# Altium schematic sheet DSub_Analog_Input.SchDoc
size A4; CompanyName: Technische Hochschule Nürnberg Georg Simon Ohm; Organization: UltraZohm; Address1: Kesslerplatz 12; Address2: 90489 Nürnberg; Address3: GERMANY; SheetNumber: 3; SheetTotal: 6; Website: www.ultrazohm.com
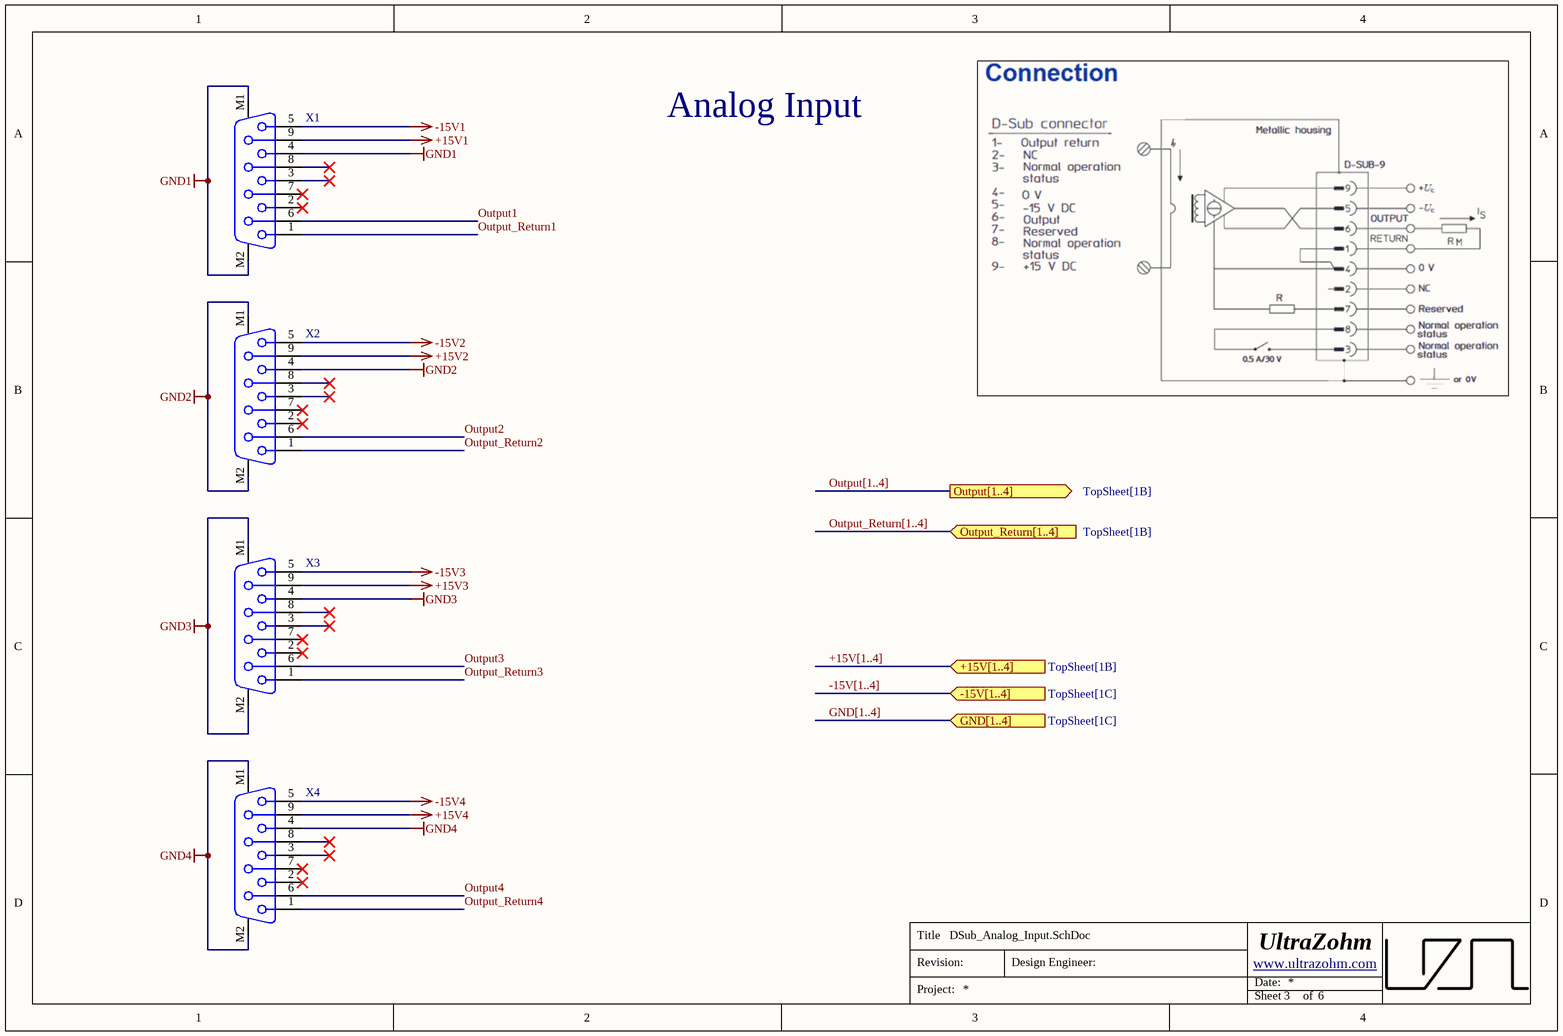
[diagram p0: DSub_Analog_Input.SchDoc]

## Parts
X1  D-SUB 9, female  [618009231121]  (value not drawn)
X2  D-SUB 9, female  [618009231121]  (value not drawn)
X3  D-SUB 9, female  [618009231121]  (value not drawn)
X4  D-SUB 9, female  [618009231121]  (value not drawn)

## Ports
+15V[1..4] (in, see TopSheet[1B]), -15V[1..4] (in, see TopSheet[1C]), GND[1..4] (in, see TopSheet[1C]), Output[1..4] (out, see TopSheet[1B]), Output_Return[1..4] (in, see TopSheet[1B])

## Nets
+15V1: X1.9
+15V2: X2.9
+15V3: X3.9
+15V4: X4.9
-15V1: X1.5
-15V2: X2.5
-15V3: X3.5
-15V4: X4.5
GND1: X1.4 X1.M1 X1.M2
GND2: X2.4 X2.M1 X2.M2
GND3: X3.4 X3.M1 X3.M2
GND4: X4.4 X4.M1 X4.M2
Output1: X1.6
Output2: X2.6
Output3: X3.6
Output4: X4.6
Output_Return1: X1.1
Output_Return2: X2.1
Output_Return3: X3.1
Output_Return4: X4.1

Not connected (* = marked no-connect by the designer): X1 2* 3* 7* 8*; X2 2* 3* 7* 8*; X3 2* 3* 7* 8*; X4 2* 3* 7* 8*

## Buses and harness runs
bus +15V[1..4] = port +15V[1..4]
bus -15V[1..4] = port -15V[1..4]
bus GND[1..4] = port GND[1..4]
bus Output[1..4] = port Output[1..4]
bus Output_Return[1..4] = port Output_Return[1..4]

## Notes on the sheet
- Analog Input
- Title
- Revision:
- Design Engineer:
- Date:
- Project:
- Sheet
- of

## Library data of the parts
X1-X4 = 618009231121: D-Sub Standard Connectors WR-DSUB Female PCB 9Pin Hex Scrw 8.08mm; Manufacturer: Wuerth Elektronik; Contact Resistance: 30mOhm; Rated Current: 3A; Working Voltage: 125VAC; Withstanding Voltage: 1000VAC; Created from: AGeiger; Manufacturer Part Number: 618009231121; Category: Input/Output Connectors; Match Code: WR-DSUB; ComponentLink1Description: Datasheet; ComponentLink1URL: https://www.we-online.com/components/products/datasheet/618009231121.pdf; ComponentLink2Description: Datasheet Link; ComponentLink2URL: https://www.we-online.com/redexpert/spec/618009231121?ad; Mount: Through Hole; Operating Temperature Max: 105°C; Operating Temperature Min: -55°C; Packaging: Tray; Gender: Female; Number of Pins: 9; Orientation: Angled; PartID: 6; Created On: 31/05/2023 13:23:16; Last Updated: 31/05/2023 13:23:16; Mounting Type: THT; Operating Temperature: -40 °C to +85 °C; Series: D-SUB Standard; Supplier 1: Mouser; Supplier Part Number 1: 710-618009231121; Value: D-SUB 9, female; LCSC Part Number: C141882